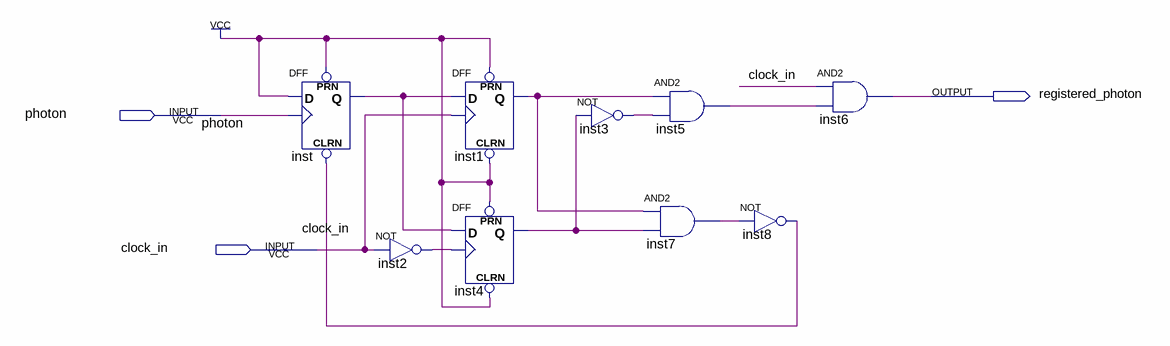
[diagram p0: schematic sheet]
// Quartus schematic registerPhotonsRisingHalf.bdf as structural Verilog: 9 symbols, 3 pins
module registerPhotonsRisingHalf (
  input  photon,
  input  clock_in,
  output registered_photon
);

  wire inst1_q, inst2_out, inst3_out, inst4_q, inst5_out, inst7_out, inst8_out, inst_q;

  DFF inst (.CLRN(inst8_out), .CLK(photon), .D(1'b1), .PRN(1'b1), .Q(inst_q));
  not inst2 (inst2_out, clock_in);
  DFF inst1 (.CLRN(1'b1), .CLK(clock_in), .D(inst_q), .PRN(1'b1), .Q(inst1_q));
  DFF inst4 (.CLRN(1'b1), .CLK(inst2_out), .D(inst_q), .PRN(1'b1), .Q(inst4_q));
  not inst3 (inst3_out, inst4_q);
  and inst7 (inst7_out, inst1_q, inst4_q);
  and inst5 (inst5_out, inst1_q, inst3_out);
  not inst8 (inst8_out, inst7_out);
  and inst6 (registered_photon, clock_in, inst5_out);
endmodule
